# Altium schematic sheet LCL_CAN.SchDoc
size A4; Organization: Altium Limited; Address1: L3, 12a Rodborough Rd; Address2: Frenchs Forest; Address3: NSW; Address4: Australia 2086; DocumentNumber: 14; SheetNumber: 14; SheetTotal: 19
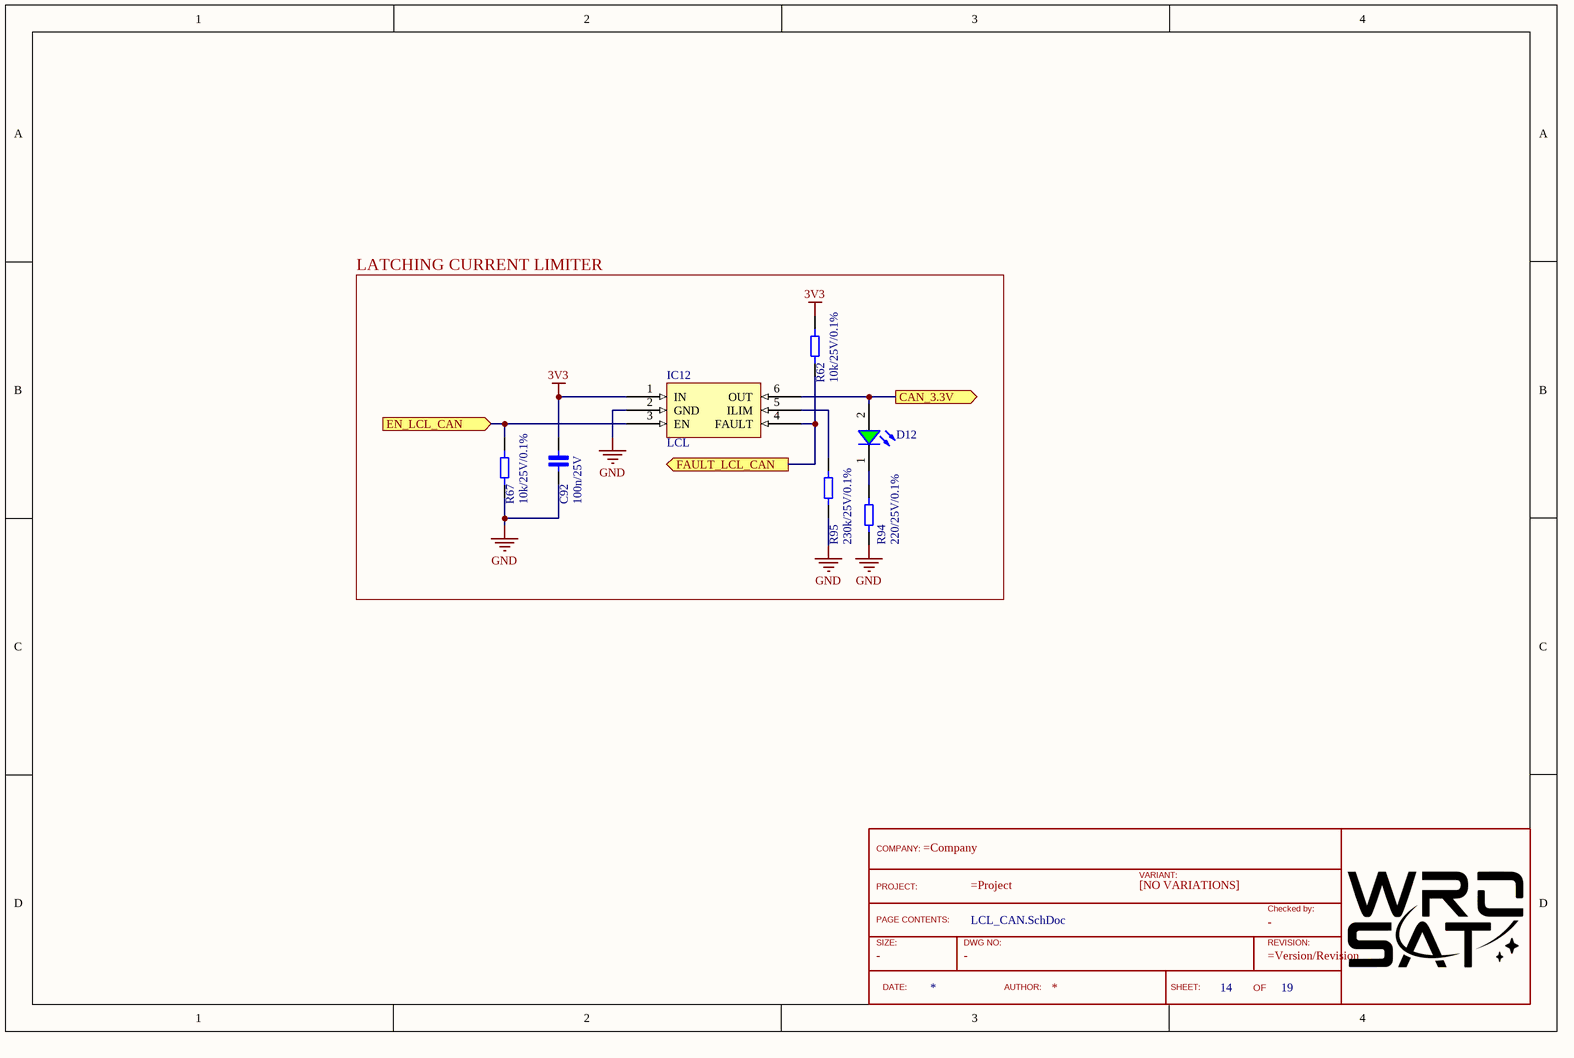
[diagram p0: LCL_CAN.SchDoc]

## Parts
?  TitleBlock  (value not drawn)  (graphical)
C92  100n/25V  [Cap_0402]
D12  Green, 3.2V  [WL-SMCW_0603_H=0.7mm]  (value not drawn)
IC12  LCL  [SOT-23-6]
R62  10k/25V/0.1%  [RES_0402]
R67  10k/25V/0.1%  [RES_0402]
R94  220/25V/0.1%  [RES_0402]
R95  230k/25V/0.1%  [RES_0402]

## Blocks framed on the sheet
LATCHING CURRENT LIMITER: C92 D12 IC12 R62 R67 R94 R95

## Ports
CAN_3.3V (out), EN_LCL_CAN (in), FAULT_LCL_CAN (out)

## Nets
3V3: C92.2 IC12.1(IN) R62.2
GND: C92.1 IC12.2(GND) R67.1 R94.1 R95.1
CAN_3.3V: D12.2(A) IC12.6(OUT) ; port CAN_3.3V
EN_LCL_CAN: IC12.3(EN) R67.2 ; port EN_LCL_CAN
FAULT_LCL_CAN: IC12.4(FAULT) R62.1 ; port FAULT_LCL_CAN
NetD12_1: D12.1(K) R94.2
NetIC12_5: IC12.5(ILIM) R95.2

## Notes on the sheet
- Title
- Size:
- Date:
- A3
- Number:
- Time:
- Revision:
- Sheet
- of
- File:
- (in symbol TitleBlock) COMPANY:; VARIANT:; PROJECT:; [NO VARIATIONS]; Checked by:; PAGE CONTENTS:; SIZE:; DWG NO:; REVISION:; DATE:; AUTHOR:; SHEET:; OF

## Library data of the parts
? = TitleBlock: Standard TitleBlock; DrawingNo: -; Size: -; Checked: -
C92 = Cap_0402_100n: Ceramic Capacitor 100n / 0402 / 25V / ±5%, Wurth Elektronik MLCC; ComponentLink1Description: New link; ComponentLink1URL: https://www.we-online.com/catalog/en/WCAP-CSGP-25VDC
D12 = 150060GS75000: WL-SMCW SMT Mono-color Chip LED Waterclear, size 0603, Green, 3.2V, 140deg; Chip Technology: InGaN; Dominant Wavelength typ.: 525nm; Luminous Intensity typ.: 430mcd; Peak Wavelength typ.: 515nm; Viewing Angle: 140deg; ComponentLink1Description: Manufacturer; ComponentLink1URL: http://www.we-online.de; ComponentLink2URL: https://www.we-online.com/catalog/datasheet/150060GS75000.pdf; ComponentLink2Description: Datasheet; Forward Voltage typ.: 3.2V; Emitting Color: Green; Mounting Technology: SMT; Operating Temperature: -40 to +85degC; Published Date: December 2019; Part Number: 150060GS75000; Packaging: Tape and Reel; Size: 0603; Publisher: Wurth Elektronik
IC12 = TPS2553: Latch-off Current Limiter; ComponentLink1Description: New link; ComponentLink1URL: https://www.ti.com/lit/ds/symlink/tps2553.pdf?ts=1603819295065&ref_url=https%253A%252F%252Fwww.google.com%252F
R62 R67 = Res_0402_10k: Vishay, thin film resistor 10k/25V/0.1%
R94 = Res_0402_1: Vishay, thin film resistor 1/25V/0.1%
R95 = Res_0402_230k: Vishay, thin film resistor 230k/25V/0.1%